# Altium schematic sheet buck_boost.SchDoc: Buck-Boost
size A4; DrawnBy: J. Reimer T. Yeung M. Au; Organization: UTAT SS; DocumentNumber: 5; Revision: 2.0; SheetNumber: 5; SheetTotal: 17
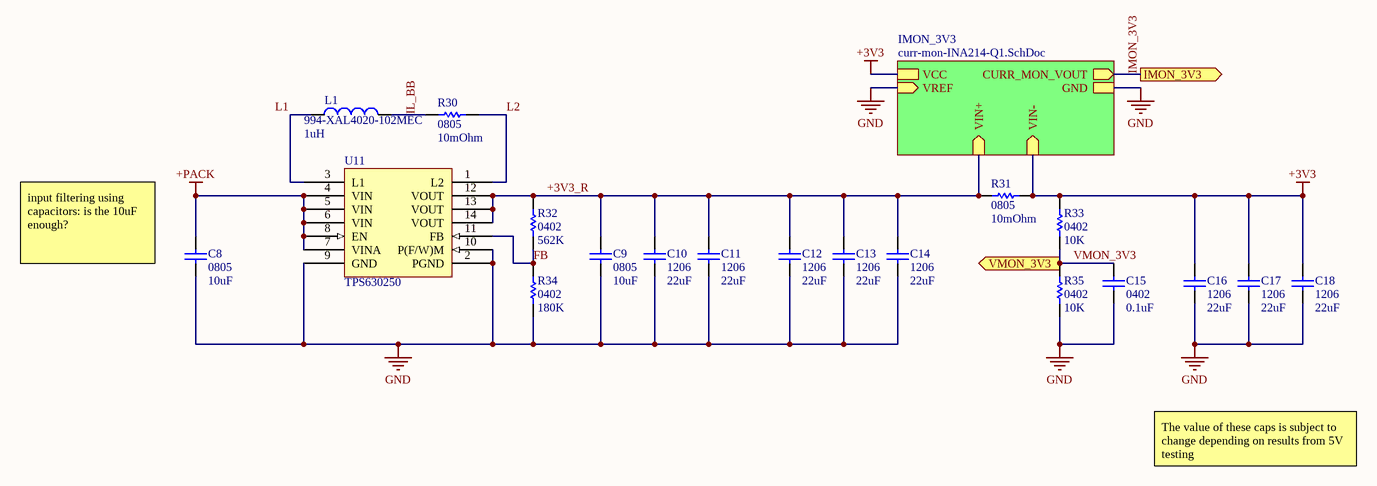
[diagram p0: buck_boost.SchDoc]

## Parts
C8  0805  value 10uF  [CAP0805R]
C9  0805  value 10uF  [CAP0805R]
C10  1206  value 22uF  [CAP1206R]
C11  1206  value 22uF  [CAP1206R]
C12  1206  value 22uF  [CAP1206R]
C13  1206  value 22uF  [CAP1206R]
C14  1206  value 22uF  [CAP1206R]
C15  0402  value 0.1uF  [CAP0402R]
C16  1206  value 22uF  [CAP1206R]
C17  1206  value 22uF  [CAP1206R]
C18  1206  value 22uF  [CAP1206R]
L1  Inductance: 1uH  Supplier Part Number 1: 994-XAL4020-102MEC  [XAL4020-102ME]  (hidden comment: IND_XAL4020-102ME)
R30  0805  value 10mOhm  [RES0805R]
R31  0805  value 10mOhm  [RES0805R]
R32  0402  value 562K  [RES0402R]
R33  0402  value 10K  [RES0402R]
R34  0402  value 180K  [RES0402R]
R35  0402  value 10K  [RES0402R]
U11  TPS630250  [RNC0014A]

## Sub-sheets
IMON_3V3 = curr-mon-INA214-Q1.SchDoc: VREF (in), VIN+ (in), VCC, GND, VIN- (in), CURR_MON_VOUT (out)

## Ports
IMON_3V3 (out), VMON_3V3 (out)

## Nets
+3V3: C16.2 C17.2 C18.2 R31.2 R33.2 ; sheet IMON_3V3/VCC, sheet IMON_3V3/VIN-
+PACK: C8.2 U11.4(VIN) U11.5(VIN) U11.6(VIN) U11.7(VINA) U11.8(EN)
GND: C8.1 C9.1 C10.1 C11.1 C12.1 C13.1 C14.1 C15.1 C16.1 C17.1 C18.1 R34.1 R35.1 U11.2(PGND) U11.9(GND) U11.10(P(F/W)M) ; sheet IMON_3V3/VREF, sheet IMON_3V3/GND
+3V3_R: C9.2 C10.2 C11.2 C12.2 C13.2 C14.2 R31.1 R32.2 U11.12(VOUT) U11.13(VOUT) U11.14(VOUT) ; sheet IMON_3V3/VIN+
FB: R32.1 R34.2 U11.11(FB)
IL_BB: L1.2 R30.1
IMON_3V3: port IMON_3V3, sheet IMON_3V3/CURR_MON_VOUT
L1: L1.1 U11.3(L1)
L2: R30.2 U11.1(L2)
VMON_3V3: C15.2 R33.1 R35.2 ; port VMON_3V3

## Notes on the sheet
- (near C8) input filtering using capacitors: is the 10uF enough?
- The value of these caps is subject to change depending on results from 5V testing

## Library data of the parts
C8 C9 = CAP0805: 0805 capacitor
C10-C14 C16-C18 = CAP1206: 1206 capacitor
C15 = CAP0402: 0402 capacitor
L1 = IND_XAL4020-102ME: 1uH 20% 9.6A 14.60mOhms AEC-Q200; Manufacturer: Coilcraft; Manufacturer Part Number: XAL4020-102MEC; Core Material: Composite; Self Resonant Frequency: 79MHz; Shielding: Shielded; DC Resistance (DCR): 14.6mR; Test Frequency: 100kHz; Supplier 1: Mouser; Stock 1: 13905; Pricing 1: 1=1.8, 10=1.8, 50=1.8, 100=1.44, 500=0.944, 1000=0.869, 2000=0.809, 10000=0.809 (USD); Min Operating Temperature: -40°C; Max Operating Temperature: 125°C; Packaging: Tape and Reel; Package Quantity: 1000; Tolerance: 20%; Max DC Current: 9.6A; Termination: SMD/SMT; Length: 4.3mm; Height: 2.1mm; Width: 4.3mm; Lead Free: Contains Lead
R30 R31 = RES0805: 0805 resistor; Manufacturer: Panasonic; Manufacturer Part Number: ERJ-8BWJR010V; Resistance: 10mR; Power Rating: 1W; Tolerance: 5%; Temperature Coefficient: 200ppm/°C; Supplier 1: Digi-Key; Supplier Part Number 1: P.010AVDKR-ND; Stock 1: 70650; Pricing 1: 1=0.68, 10=0.5, 100=0.2911, 1000=0.16327, 2500=0.15763 (USD); Mount: Surface Mount; Case/Package: 1206; Case Code (Imperial): 1206; Case Code (Metric): 3216; Contact Plating: Tin; Min Operating Temperature: -55°C; Max Operating Temperature: 155°C; Packaging: Tape and Reel; Package Quantity: 1; Termination: SMD/SMT; Composition: Thick Film; Number of Terminations: 2; Military Standard: Not; Max Power Dissipation: 1W; Features: Automotive AEC-Q200; Length: 3.2mm; Height: 0.65mm; Width: 1.6mm; Depth: 1.6mm; Radiation Hardening: No; Lead Free: Lead Free; ComponentLink1URL: http://industrial.panasonic.com/www-data/pdf/AOA0000/AOA0000CE3.pdf?src-supplier=Avnet; ComponentLink1Description: http://industrial.panasonic.com/www-data/pdf/AOA0000/AOA0000CE3.pdf?src-supplier=Avnet; ComponentLink2URL: https://industrial.panasonic.com/cdbs/www-data/pdf/RDN0000/AOA0000C313.pdf?src-supplier=Digi-Key; ComponentLink2Description: https://industrial.panasonic.com/cdbs/www-data/pdf/RDN0000/AOA0000C313.pdf?src-supplier=Digi-Key; ComponentLink3URL: http://uk.rs-online.com/webdocs/13b8/0900766b813b869e.pdf?src-supplier=RSComponents; ComponentLink3Description: http://uk.rs-online.com/webdocs/13b8/0900766b813b869e.pdf?src-supplier=RSComponents
R32-R35 = RES0402: 0402 resistor
U11 = TPS630250: Buck-boost converter; Supplier 1: Digi-Key; Supplier Part Number 1: 296-42036-6-ND